# Altium schematic sheet Sheet3.SchDoc: {Title}
size 420 x 297 mm; Date: 2018-01-17; ApprovedBy: {ApprovedBy}; CheckedBy: {TechnicalReference}; Author: {CreatedBy}; CompanyName: Diakont; DocumentNumber: ЭИТЦЯ.468332.338 Э3; Revision: A; SheetNumber: 3; Title0: {Title0}; DocumentType: {DocumentType}; TechControl: {TechControl}; PageSetup: Record=PageOptions|CenterHorizontal=True|CenterVertical=True|PrintScale=0.96|XCorrection=1.00|YCorrection=1.00|PrintKind=1|BorderSize=5000000|LeftOffset=0|BottomOffset=0|Orientation=2|PaperLength=1000|PaperWidth=1000|Scale=100|PaperSource=7|PrintQuality=-4|MediaType=1|DitherType=10|PaperKind=A3|PrintScaleMode=1; Language: en; ResponsibleDept: DED; DocumentStatus: Released; DecimalNumber: ЭИТЦЯ.468332.338 Э3
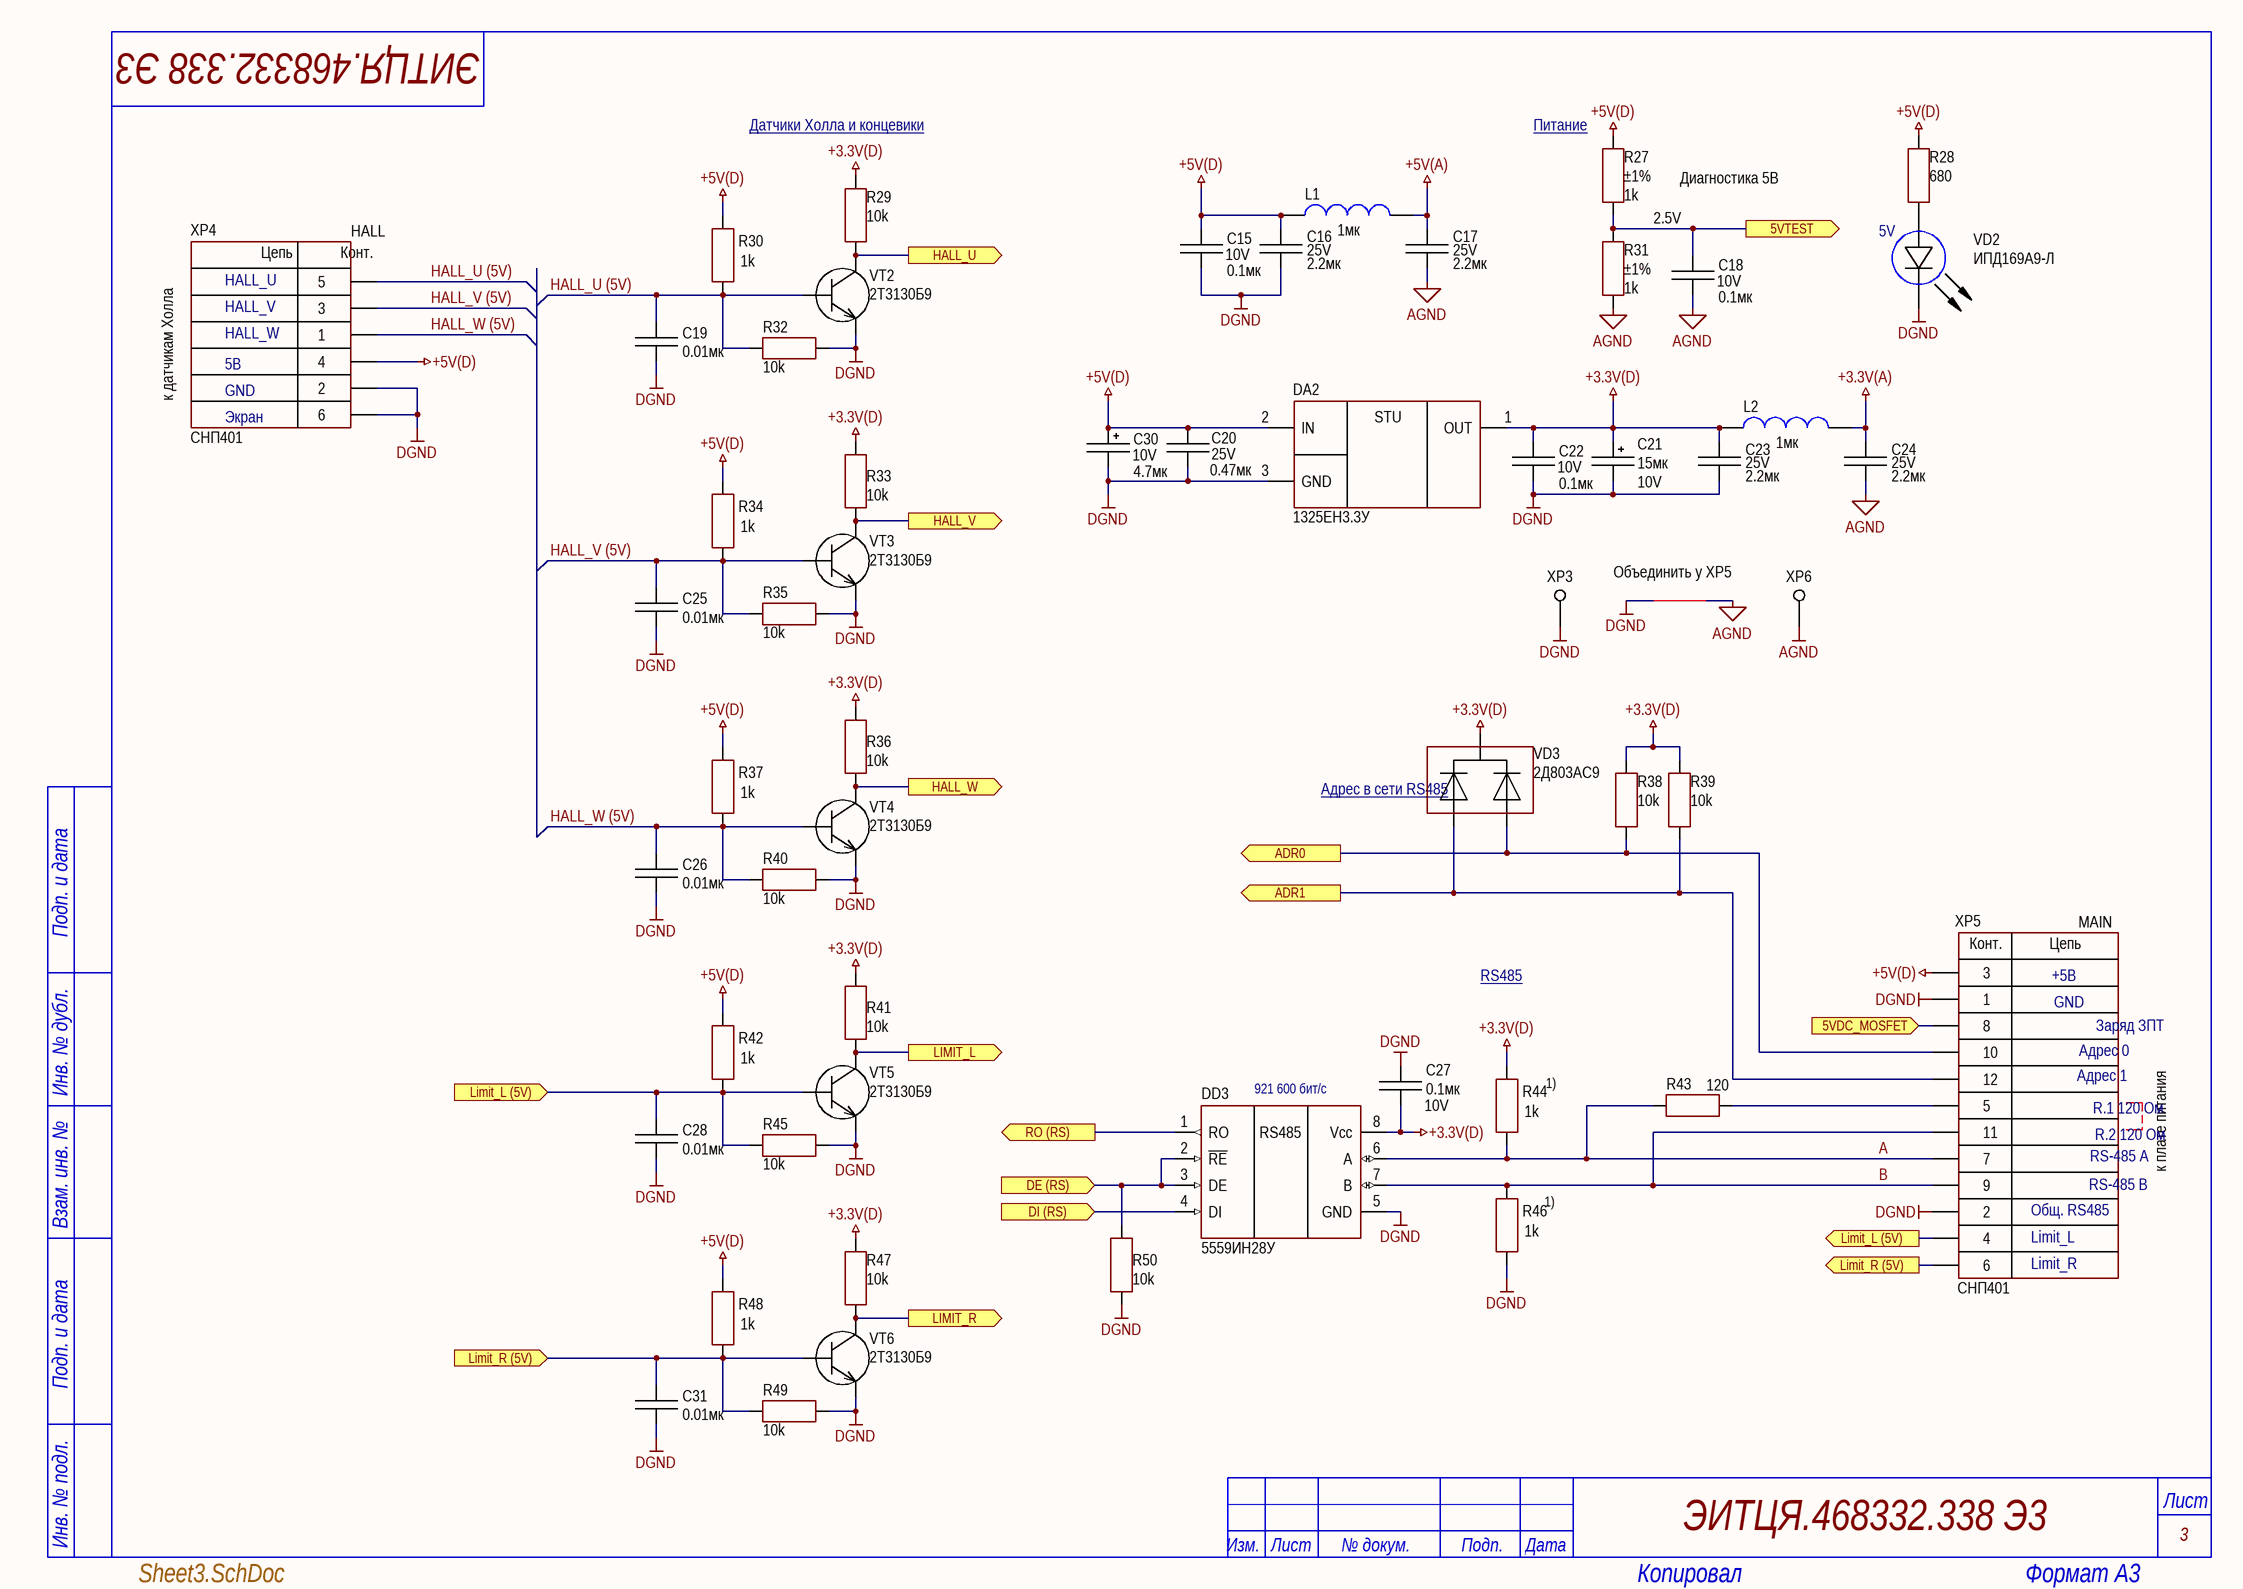
[diagram p0: Sheet3.SchDoc]

## Parts
C15  value 0.1мк  Voltage: 10V  [CAP: 0603P]
C16  value 2.2мк  Voltage: 25V  [CAP: 1210]  (hidden comment: Ceramic capacitor, 4.7мк, H90, +80 -20%, 25V, 1812 (4532М) (4.5x3.2), -55...+125°C)
C17  value 2.2мк  Voltage: 25V  [CAP: 1210]  (hidden comment: Ceramic capacitor, 4.7мк, H90, +80 -20%, 25V, 1812 (4532М) (4.5x3.2), -55...+125°C)
C18  value 0.1мк  Voltage: 10V  [CAP: 0603P]
C19  value 0.01мк  [CAP: 0603P]
C20  value 0.47мк  Voltage: 25V  [CAP: 1210]
C21  value 15мк  Voltage: 10V  [CAP: TANTAL-B]
C22  value 0.1мк  Voltage: 10V  [CAP: 0603P]
C23  value 2.2мк  Voltage: 25V  [CAP: 1210]  (hidden comment: Ceramic capacitor, 4.7мк, H90, +80 -20%, 25V, 1812 (4532М) (4.5x3.2), -55...+125°C)
C24  value 2.2мк  Voltage: 25V  [CAP: 1210]  (hidden comment: Ceramic capacitor, 4.7мк, H90, +80 -20%, 25V, 1812 (4532М) (4.5x3.2), -55...+125°C)
C25  value 0.01мк  [CAP: 0603P]
C26  value 0.01мк  [CAP: 0603P]
C27  value 0.1мк  Voltage: 10V  [CAP: 0603P]
C28  value 0.01мк  [CAP: 0603P]
C30  value 4.7мк  Voltage: 10V  [CAP: TANTAL-A]
C31  value 0.01мк  [CAP: 0603P]
DA2  PartNumber: 1325ЕН3.3У  [KT-93-1]
DD3  5559ИН28У  [Н02.8-1В]
L1  value 1мк  [IND: 0603]
L2  value 1мк  [IND: 0603]
NT1  (no value)  [NetTie_0603]  (net tie, no BOM)
R27  value 1k  Tolerance: ±1%  [RES: 0603P]
R28  value 680  [RES: 0603P]
R29  value 10k  [RES: 0603P]
R30  value 1k  [RES: 0603P]
R31  value 1k  Tolerance: ±1%  [RES: 0603P]
R32  value 10k  [RES: 0603P]
R33  value 10k  [RES: 0603P]
R34  value 1k  [RES: 0603P]
R35  value 10k  [RES: 0603P]
R36  value 10k  [RES: 0603P]
R37  value 1k  [RES: 0603P]
R38  value 10k  [RES: 0603P]
R39  value 10k  [RES: 0603P]
R40  value 10k  [RES: 0603P]
R41  value 10k  [RES: 0603P]
R42  value 1k  [RES: 0603P]
R43  value 120  [RES: 0805P]
R44  value 1k  [RES: 0603P]
R45  value 10k  [RES: 0603P]
R46  value 1k  [RES: 0603P]
R47  value 10k  [RES: 0603P]
R48  value 1k  [RES: 0603P]
R49  value 10k  [RES: 0603P]
R50  value 10k  [RES: 0603P]
VD2  PartNumber: ИПД169А9-Л  CommentText: 5V  [LED: 0603G]
VD3  PartNumber: 2Д803АС9  [SOT23]
VT2  PartNumber: 2Т3130Б9  [SOT23]
VT3  PartNumber: 2Т3130Б9  [SOT23]
VT4  PartNumber: 2Т3130Б9  [SOT23]
VT5  PartNumber: 2Т3130Б9  [SOT23]
VT6  PartNumber: 2Т3130Б9  [SOT23]
XP3  DGND  [CON: PLS2-1]  (value not drawn)
XP4  CommentText: СНП401  [CON: M80-5000605]
XP5  CommentText: СНП401  [CON: M80-5001205]
XP6  AGND  [CON: PLS2-1]  (value not drawn)

## Ports
5VDC_MOSFET (in), 5VTEST (out), ADR0 (out), ADR1 (out), DE (RS) (in), DI (RS) (in), HALL_U (out), HALL_V (out), HALL_W (out), Limit_L (5V) (in), Limit_L (5V) (out), LIMIT_L (out), Limit_R (5V) (in), Limit_R (5V) (out), LIMIT_R (out), RO (RS) (out)

## Nets
+3.3V(A): C24.2 L2.1
+3.3V(D): C21.1 C22.2 C23.2 C27.1 DA2.1(OUT) DD3.8(Vcc) L2.2 R29.1 R33.1 R36.1 R38.1 R39.1 R41.1 R44.1 R47.1 VD3.3
+5V(A): C17.2 L1.1
+5V(D): C15.2 C16.2 C20.2 C30.1 DA2.2(IN) L1.2 R27.1 R28.1 R30.1 R34.1 R37.1 R42.1 R48.1 XP4.4 XP5.3
AGND: C17.1 C18.1 C24.1 NT1.2 R31.2 XP6.1
DGND: C15.1 C16.1 C19.2 C20.1 C21.2 C22.1 C23.1 C25.2 C26.2 C27.2 C28.2 C30.2 C31.2 DA2.3(GND) DD3.5(GND) DD3.9(TP) NT1.1 R32.1 R35.1 R40.1 R45.1 R46.2 R49.1 R50.2 VD2.2(C) VT2.2(E) VT3.2(E) VT4.2(E) VT5.2(E) VT6.2(E) XP3.1 XP4.2 XP4.6 XP5.1 XP5.2
5VDC_MOSFET: XP5.8 ; port 5VDC_MOSFET
5VTEST: C18.2 R27.2 R31.1 ; port 5VTEST
A: DD3.6(A) R43.2 R44.2 XP5.7
ADR0: R38.2 VD3.2 XP5.10 ; port ADR0
ADR1: R39.2 VD3.1 XP5.12 ; port ADR1
B: DD3.7(B) R46.1 XP5.9 XP5.11
DE (RS): DD3.2(~{RE}) DD3.3(DE) R50.1 ; port DE (RS)
DI (RS): DD3.4(DI) ; port DI (RS)
HALL_U: R29.2 VT2.3(C) ; port HALL_U
HALL_U (5V): C19.1 R30.2 R32.2 VT2.1(B) XP4.5
HALL_V: R33.2 VT3.3(C) ; port HALL_V
HALL_V (5V): C25.1 R34.2 R35.2 VT3.1(B) XP4.3
HALL_W: R36.2 VT4.3(C) ; port HALL_W
HALL_W (5V): C26.1 R37.2 R40.2 VT4.1(B) XP4.1
LIMIT_L: R41.2 VT5.3(C) ; port LIMIT_L
Limit_L (5V): C28.1 R42.2 R45.2 VT5.1(B) XP5.4 ; port Limit_L (5V)
LIMIT_R: R47.2 VT6.3(C) ; port LIMIT_R
Limit_R (5V): C31.1 R48.2 R49.2 VT6.1(B) XP5.6 ; port Limit_R (5V)
RO (RS): DD3.1(RO) ; port RO (RS)
NetR28_2: R28.2 VD2.1(A)
NetR43_1: R43.1 XP5.5

## Notes on the sheet
- Датчики Холла и концевики
- Питание
- Диагностика 5В
- (near XP4) HALL
- 2.5V
- HALL_U
- HALL_V
- к датчикам Холла
- HALL_W
- 5В
- GND
- Экран
- (near NT1) Объединить у XP5
- Адрес в сети RS485
- MAIN
- RS485
- +5В
- Адрес 0
- Заряд ЗПТ
- (near DD3) 921 600 бит/с
- (near R44) 1)
- Адрес 1
- (near XP5) R.1 120 Ом
- (near R46) 1)
- RS-485 B
- RS-485 A
- (near XP5) R.2 120 Ом
- к плате питания
- Limit_L
- Limit_R
- Общ. RS485
- Подп. и дата
- Инв. № дубл.
- Взам. инв. №
- Инв. № подл.
- Лист
- Изм.
- № докум.
- Подп.
- Дата
- Копировал
- Формат A3
- (in symbol 1325ЕР1У) STU
- (in symbol 5559ИН28У) RS485
- (in symbol M80-5000605 Harwin) Цепь; Конт.
- (in symbol M80-5001205 Harwin) Конт.; Цепь

## Library data of the parts
C15 C18 C22 C27 = Ceramic_0603: Manufacturer: Гириконд; PartNumber: К10-79-10В-0,1 мкФ +80-20% H90; ValueManufacturerPartNumber: Ceramic capacitor, 0.1мк, H90, +80-20%, 10V, 0603, -55...+125°C; TypeCapacitor: Ceramic capacitor; Tolerance: +80-20%; TypeDielectric: H90; Package: 0603; HelpURL: http://www.giricond.ru/files/k10-79_vp_2018_saiyt.pdf; Temperature: -55...+125°C
C16 C17 C23 C24 = Ceramic_1210: Manufacturer: Монолит; PartNumber: К10-84в-3225М-25В-2,2 мкФ +80/-20%-Н90-N-A; Package: 1210 (3225М); HelpURL: https://www.digikey.com/product-detail/en/yageo/CC1210KKX7R9BB104/311-4522-1-ND/8025611; ValueManufacturerPartNumber: Ceramic capacitor, 4.7мк, H90, +80 -20%, 25V, 1812 (4532М) (4.5x3.2), -55...+125°C; Temperature: -55...+125°C; TypeCapacitor: Ceramic capacitor; Tolerance: +80 -20%; TypeDielectric: H90
C19 C25 C26 C28 C31 = Ceramic_0603: Manufacturer: Монолит; PartNumber: К10-84в-1608М-50В-0.01мк ±20%-Н20-N-A; ValueManufacturerPartNumber: Ceramic capacitor, 0.01мк, H20, ±20%, 50V, 0603, -55...+125°C; TypeCapacitor: Ceramic capacitor; Tolerance: ±20%; TypeDielectric: H20; Voltage: 50V; Analog: MAX 00131676 (pin-to-pin); Package: 0603; HelpURL: http://www.monolit.vitebsk.by/Files/K10-84.pdf; Temperature: -55...+125°C
C20 = Ceramic_0603: Manufacturer: Монолит; PartNumber: К10-84в-3225М-25В-0,47 мкФ ±10%-Н20-N-A; ValueManufacturerPartNumber: Ceramic capacitor, 0.47мк, Н20, ±10%, 25V, 1210 (3225M),; TypeCapacitor: Ceramic capacitor; Tolerance: ±10%; TypeDielectric: Н20; Analog: MAX 00150226; Package: 1210 (3225M); HelpURL: http://www.monolit.vitebsk.by/Files/K10-84.pdf
C21 = Tantal_B: Manufacturer: "Элеконд"; PartNumber: К53-68 В-10 В-15 мкФ ±10%; ValueManufacturerPartNumber: Tantalum capacitor, 15мк, 10V, ±10%, , case B (3528), -55...+125°C; Tolerance: ±10%; TypeCapacitor: Tantalum capacitor; MAX: 00130628; Package: case B (3528); Temperature: -55...+125°C
C30 = Tantal_A: Manufacturer: Элеконд; PartNumber: К53-68 "А"-10 В-4.7 мкф; ValueManufacturerPartNumber: Tantalum capacitor, 4.7мк, 10V, ±10%, 2Ohm, case A (3216), -55...+125°C; Impedance: 2Ohm; Tolerance: ±10%; TypeDielectric: X7R; TypeCapacitor: Tantalum capacitor; MAX: 00130629; Package: case A (3216); HelpURL: https://www.digikey.com/product-detail/en/avx-corporation/F930J107KAAAJ6/478-12404-1-ND/9645231; Temperature: -55...+125°C
DA2 = 1325ЕР1У: Linear voltage regulator 3V3; Manufacturer: Интеграл; ValueManufacturerPartNumber: Linear voltage regulator, input 4.75...15V, 1.3V, output 3.3V, 0.8A, -40...+85°C, КТ-93-1; VoltageInput: input 4.75...15V; MaxDropout: 1.3V; CurrentOutput: 0.8A; VoltageOutput: output 3.3V; MAX: 00141284; HelpURL: https://www.integral.by/sites/default/files/pdf/specifikaciya_serii_1325.pdf; Package: КТ-93-1; ComponentType: Linear voltage regulator; Temperature: -40...+85°C
DD3 = 5559ИН28У: RS485 USSR; Manufacturer: Миландр; Supply: 3-5V; DataRate: 30 Mbs; MAX: 00148111; Type: RS-485 transceiver; Package: Н02.8-1В; PartNumber: 5559ИН28У; HelpURL: https://ic.milandr.ru/products/interfeysnye_mikroskhemy/rs485-rs422/5559in28u/
L1 L2 = Inductor_0603: Manufacturer: ЭРКОН; PartNumber: КИФ1608-1000 нГн ±20% О-А РКМУ.671340.002 ТУ; ValueManufacturerPartNumber: Fixed inductor, 1мк, ±20%, 0603, 400mA, -55...+125°C; TypeInductor: Fixed inductor; MaxCurrent: 400mA; Tolerance: ±20%; R: 0,8 Ом; Package: 0603; HelpURL: https://www.erkon-nn.ru/catalog/14/kif-vp/; Temperature: -55...+125°C
NT1 = NetTie
R27 R31 = Resistor_0603: Manufacturer: ОАО Ресурс; PartNumber: Р1-12-0,1ум.-1~кОм ±1%-М ШКАБ.434110.002 ТУ; ValueManufacturerPartNumber: Resistor film, 1k, ±1%, 0603, 0.1W, -55...+125°C; TypeResistor: Resistor film; Power: 0.1W; MAX: 00133971; Package: 0603; HelpURL: https://aoresurs.com/catalog/chip_rezistory/rezistory-r1-12-kategoriya-kachestva-vp-/; Temperature: -55...+125°C
R28 = Resistor_0603: Manufacturer: ОАО Ресурс; PartNumber: Р1-12-0,1ум.-680~кОм ±5%-М ШКАБ.434110.002 ТУ; ValueManufacturerPartNumber: Resistor film, 680, ±5%, 0603, 0.1W, -55...+125°C; TypeResistor: Resistor film; Power: 0.1W; Tolerance: ±5%; MAX: 00134086; Package: 0603; HelpURL: https://aoresurs.com/catalog/chip_rezistory/rezistory-r1-12-kategoriya-kachestva-vp-/; Temperature: -55...+125°C
R29 R32 R33 R35 R36 R38-R41 R45 R47 R49 R50 = Resistor_0603: Manufacturer: ОАО Ресурс; PartNumber: Р1-12-0,1ум.-10~кОм ±5%-М ШКАБ.434110.002 ТУ; ValueManufacturerPartNumber: Resistor film, 10k, ±5%, 0603, 0.1W, -55...+125°C; TypeResistor: Resistor film; Power: 0.1W; Tolerance: ±5%; MAX: 00133985; Analog: MAX 00133986 (1%); Package: 0603; HelpURL: https://aoresurs.com/catalog/chip_rezistory/rezistory-r1-12-kategoriya-kachestva-vp-/; Temperature: -55...+125°C
R30 R34 R37 R42 R44 R46 R48 = Resistor_0603: Manufacturer: ОАО Ресурс; PartNumber: Р1-12-0,1ум.-1~кОм ±1%-М ШКАБ.434110.002 ТУ; ValueManufacturerPartNumber: Resistor film, 1k, ±1%, 0603, 0.1W, -55...+125°C; TypeResistor: Resistor film; Power: 0.1W; Tolerance: ±1%; MAX: 00133971; Package: 0603; HelpURL: https://aoresurs.com/catalog/chip_rezistory/rezistory-r1-12-kategoriya-kachestva-vp-/; Temperature: -55...+125°C
R43 = Resistor_0805: Manufacturer: Русские; PartNumber: Р1-12-0.125-120 Ом±5%-М; ValueManufacturerPartNumber: Resistor film, 120, ±5%, 0805, 0.125W, -55...+125°C; TypeResistor: Resistor film; Power: 0.125W; Tolerance: ±5%; MAX: 00133848; Package: 0805; Temperature: -55...+125°C
VD2 = LED_single: Manufacturer: Протон; ValueManufacturerPartNumber: LED, 20mA max, 1.9V@4mA, 1608, -55...+150°C; TypeDiode: LED; Current: 20mA max; VoltageDrop: 1.9V@4mA; Color: GREEN; Analog: MAX 00129484 КР-1608 Kingbright (pin-to-pin); Package: 1608; HelpURL: *; Temperature: -55...+150°C
VD3 = Diode_array2: Manufacturer: Россия; ValueManufacturerPartNumber: Diode array common anode, 50V, 200mA, 1.1V, , SOT-23,; TypeDiode: Diode array common anode; Voltage: 50V; Current: 200mA; VoltageDrop: 1.1V; MAX: 00122900; Package: SOT-23; HelpURL: https://www.chipdip.ru/product/2d803as9
VT2-VT6 = BJT_NPN_132: Manufacturer: ООО НПК Далекс; ValueManufacturerPartNumber: NPN transistor, 30V, 100mA, , 300mW, 0.7V, 500, SOT-23 (КТ-46), -55...+125°C; TypeTransistor: NPN transistor; VoltageCE: 30V; CurrentCE: 100mA; VoltageSaturation: 0.7V; CurrentGain: 500; MaxPower: 300mW; MAX: 00123842; Package: SOT-23 (КТ-46); HelpURL: http://www.radioman-portal.ru/sprav/pp/transisters/sourse/2t3130.pdf; Temperature: -55...+125°C
XP3 = PLS2-1: Test probe; PartNumber: СНП377-1ВП21-1; Manufacturer: Электродеталь; Tolerance: СНП377; RefDes/Designator: MAX; Шаг: 2mm; Analog: PLS2-1; MAX: *; Publisher: TEN; Published: 2019; Type: Control pin; HelpURL: https://www.elektrodetal.com/catalog/snp377/
XP4 = M80-5000605 Harwin: вилка на плату; Manufacturer: Электроделать; ValueManufacturerPartNumber: Вилка, 6pin, 2mm, 120VAC, 1.5A; PartNumber: СНП401-6ВП21-3-1-1; VoltageMax: 120VAC; Pitch: 2mm; CurrentMax: 1.5A; Multichannel: 6pin; Analog: MAX 00126397 (M80-5000605 pin-to-pin); HelpURL: https://eu.mouser.com/ProductDetail/Harwin/M80-5000605?qs=yQtJ9TWM%2F1KaJIUUBEXorg%3D%3D; TypeConnector: Вилка
XP5 = M80-5001205 Harwin: вилка на плату; Manufacturer: Электродеталь; ValueManufacturerPartNumber: Вилка, 12pin, 2mm, 100V, 1.5A; PartNumber: СНП401-12ВП21-3-1-1; VoltageMax: 100V; Pitch: 2mm; CurrentMax: 1.5A; Multichannel: 12pin; Analog: MAX 00138662 (M80-5101205 pin-to-pin); HelpURL: https://eu.mouser.com/ProductDetail/Harwin/M80-5001205?qs=yQtJ9TWM%2F1IJJSuF%2FTVm0Q==; TypeConnector: Вилка
XP6 = PLS2-1: Test probe; PartNumber: СНП377-1ВП21-1; Manufacturer: Электродеталь; Tolerance: СНП377; MAX: 00130069; Шаг: 2mm; Analog: PLS2-1; MAX: *; Publisher: TEN; Published: 2019; Type: Control pin; HelpURL: https://www.elektrodetal.com/catalog/snp377/